# Altium schematic sheet USB_FS.SchDoc
size 420 x 297 mm; DocumentNumber: 5; SheetNumber: 5; SheetTotal: 17
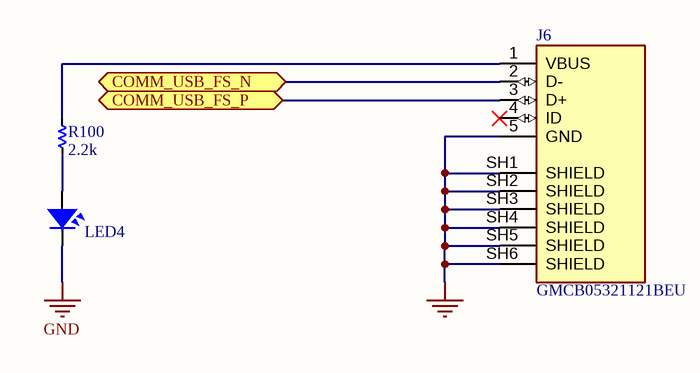
[diagram p0: USB_FS.SchDoc]

## Parts
J6  GMCB05321121BEU  [AMPHENOL_GMCB05321121BEU]
LED4  150060RS75000  [LED_0603]  (value not drawn)
R100  2.2k  [RES_C_1608X60]

## Ports
COMM_USB_FS_N (bidir), COMM_USB_FS_P (bidir)

## Nets
GND: J6.5(GND) J6.SH1(SHIELD) J6.SH2(SHIELD) J6.SH3(SHIELD) J6.SH4(SHIELD) J6.SH5(SHIELD) J6.SH6(SHIELD) LED4.2
COMM_USB_FS_N: J6.2(D-) ; port COMM_USB_FS_N
COMM_USB_FS_P: J6.3(D+) ; port COMM_USB_FS_P
NetJ6_1: J6.1(VBUS) R100.2
NetLED4_1: LED4.1 R100.1

Not connected (* = marked no-connect by the designer): J6 4(ID)*

## Notes on the sheet
- Project:
- BEE-PC1
- Sub-system:
- NANORACK_EXP_CONTROLLER
- Design by:
- SANG HUYNH
- BAO BUI Q.
- Sheet title:
- Sheet
- A3
- of
- Checked by:
- Approved by:
- VU PHAM
- Revision:
- Document No:
- V1.2.2
- Size:
- Date:

## Library data of the parts
J6 = GMCB05321121BEU: Micro USB 2.0 Type B Receptacle Right Angle SMT, Tape and Reel Packaging; MF: Amphenol Commercial Products; SnapEDA_Link: https://www.snapeda.com/parts/GMCB05321121BEU/Amphenol/view-part/?ref=snap; Package: None; Value: *; MP: GMCB05321121BEU; Check_prices: https://www.snapeda.com/parts/GMCB05321121BEU/Amphenol/view-part/?ref=eda
LED4 = LED SMD: Value: LED 3 - 5 ly 2 Colour
R100 = _RES_B_2: RES